# Altium schematic sheet ETH1G_RJ45MIDMNT.SchDoc
size A3; SheetNumber: 5; SheetTotal: 22
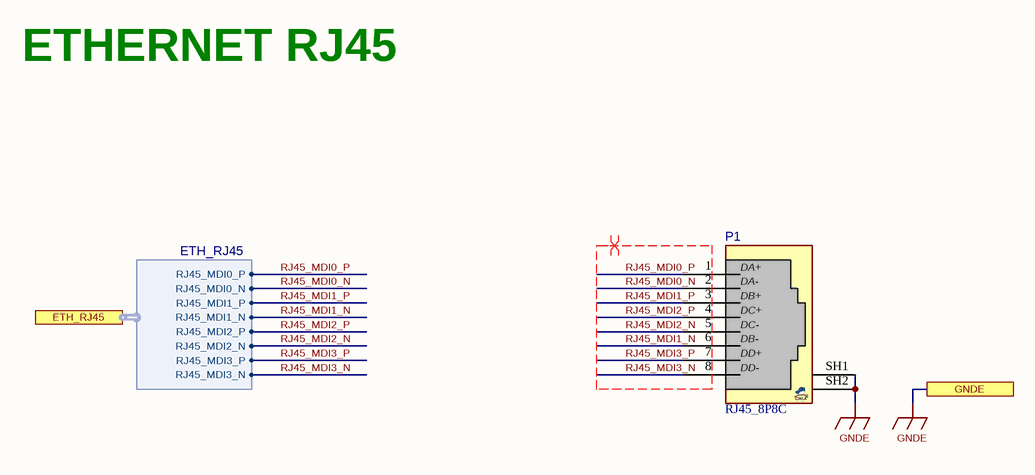
[diagram p0: ETH1G_RJ45MIDMNT.SchDoc]

## Parts
P1  RJ45_8P8C  [RJ45_8S_RA_TD_SMD]

## Ports
ETH_RJ45 (harness ETH_RJ45), GNDE

## Harnesses
ETH_RJ45: RJ45_MDI0_P, RJ45_MDI0_N, RJ45_MDI1_P, RJ45_MDI1_N, RJ45_MDI2_P, RJ45_MDI2_N, RJ45_MDI3_P, RJ45_MDI3_N

## Nets
GNDE: P1.SH1 P1.SH2 ; port GNDE
RJ45_MDI0_N: P1.2(DA-) ; port ETH_RJ45.RJ45_MDI0_N
RJ45_MDI0_P: P1.1(DA+) ; port ETH_RJ45.RJ45_MDI0_P
RJ45_MDI1_N: P1.6(DB-) ; port ETH_RJ45.RJ45_MDI1_N
RJ45_MDI1_P: P1.3(DB+) ; port ETH_RJ45.RJ45_MDI1_P
RJ45_MDI2_N: P1.5(DC-) ; port ETH_RJ45.RJ45_MDI2_N
RJ45_MDI2_P: P1.4(DC+) ; port ETH_RJ45.RJ45_MDI2_P
RJ45_MDI3_N: P1.8(DD-) ; port ETH_RJ45.RJ45_MDI3_N
RJ45_MDI3_P: P1.7(DD+) ; port ETH_RJ45.RJ45_MDI3_P

## Layout directives
differential pair: RJ45_MDI0_N, RJ45_MDI0_P, RJ45_MDI1_N, RJ45_MDI1_P, RJ45_MDI2_N, RJ45_MDI2_P, RJ45_MDI3_N, RJ45_MDI3_P

## Notes on the sheet
- ETHERNET RJ45

## Library data of the parts
P1 = RJ45_8S_RA_TD_SMD: RJ45, 8P, SHIELDED, RightAngle, TabDown, SMDEMI panel ground; MANF: Heling; MANF_P#: MJ88-B011-JRVS1-P; PRICE: 1.2$; VALUE: RJ45_8P8C